# EAGLE design Alimentatore_LM317 (EAGLE 9.5.0)
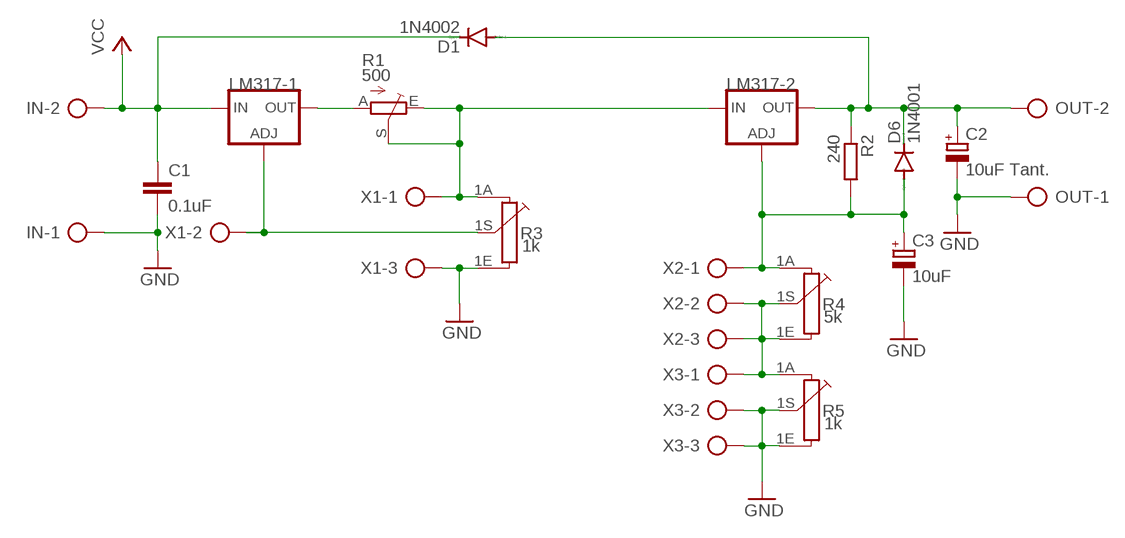
[diagram p0: schematic, sheet 1]

## Parts
C1  0.1uF  C-EU025-024X044  [C025-024X044]
C2  10uF Tant.  CPOL-EUE2-5  [E2-5]
C3  10uF  CPOL-EUE2-5  [E2-5]
D1  1N4002  1N4004DO-41  [DIOAD860W70L460D235B]
D6  1N4001  1N4004DO-41  [DIOAD860W70L460D235B]
IN  SMKDSP_1,5/2  [SMKDSP_1,5/2]
LM317-1  LM317TS317TS_TO220  [TO220V]
LM317-2  LM317TS317TS_TO220  [TO220V]
OUT  SMKDSP_1,5/2  [SMKDSP_1,5/2]
R1  500  TRIM_EU-CA6V  [CA6V]
R2  240  R-EU_0204/7  [0204/7]
R3  1k  PC16S  [PC16S]
R4  5k  PC16S  [PC16S]
R5  1k  PC16S  [PC16S]
X1  SMKDSP_1,5/3  [SMKDSP_1,5/3]
X2  SMKDSP_1,5/3  [SMKDSP_1,5/3]
X3  SMKDSP_1,5/3  [SMKDSP_1,5/3]

## Nets
GND: C1.2 C2.- C3.- IN.1 OUT.1 R3.1E R5.1E R5.1S X1.3 X3.2 X3.3
N$1: C2.+ D1.2(A) D6.1(C) LM317-2.2(OUT) OUT.2 R2.1
N$2: LM317-1.2(OUT) R1.A
N$3: LM317-2.3(IN) R1.E R1.S R3.1A X1.1
N$4: R4.1E R4.1S R5.1A X2.2 X2.3 X3.1
N$5: LM317-1.1(ADJ) R3.1S X1.2
N$9: C3.+ D6.2(A) LM317-2.1(ADJ) R2.2 R4.1A X2.1
VCC: C1.1 D1.1(C) IN.2 LM317-1.3(IN)

## Library data of the parts
C1 = rcl:C-EU: CAPACITOR, European symbol; SPICEPREFIX: C
C2 C3 = rcl:CPOL-EU: POLARIZED CAPACITOR, European symbol; SPICEPREFIX: C
D1 D6 = diode_MOD:1N4004: DIODE general purpose rectifier, 1 A
IN OUT = con-phoenix-smkdsp:SMKDSP_1,5/2: Printklemme, Nennstrom: 17,5 A, Bemessungsspannung: 250 V, Raster: 5,0 mm Source: http://eshop.phoenixcontact.de .. 1733415.pdf; MF: FARNELL; MPN: 1733570; OC_FARNELL: 3041244; OC_NEWARK: 69C8588
LM317-1 LM317-2 = v-reg:LM317TS: VOLTAGE REGULATOR
R1 = pot:TRIM_EU-: POTENTIOMETER
R2 = rcl:R-EU_: RESISTOR, European symbol; SPICEPREFIX: R
R3-R5 = piher:PC16S: POTENTIOMETER single carbon potentiometer, 16 mm, S3ROH; OC_FARNELL: 4452940; OC_NEWARK: unknown
X1-X3 = con-phoenix-smkdsp:SMKDSP_1,5/3: Printklemme, Nennstrom: 17,5 A, Bemessungsspannung: 250 V, Raster: 5,0 mm Source: http://eshop.phoenixcontact.de .. 1733415.pdf; MF: FARNELL; MPN: 1733583; OC_FARNELL: 3041256; OC_NEWARK: 71C4130

## Board
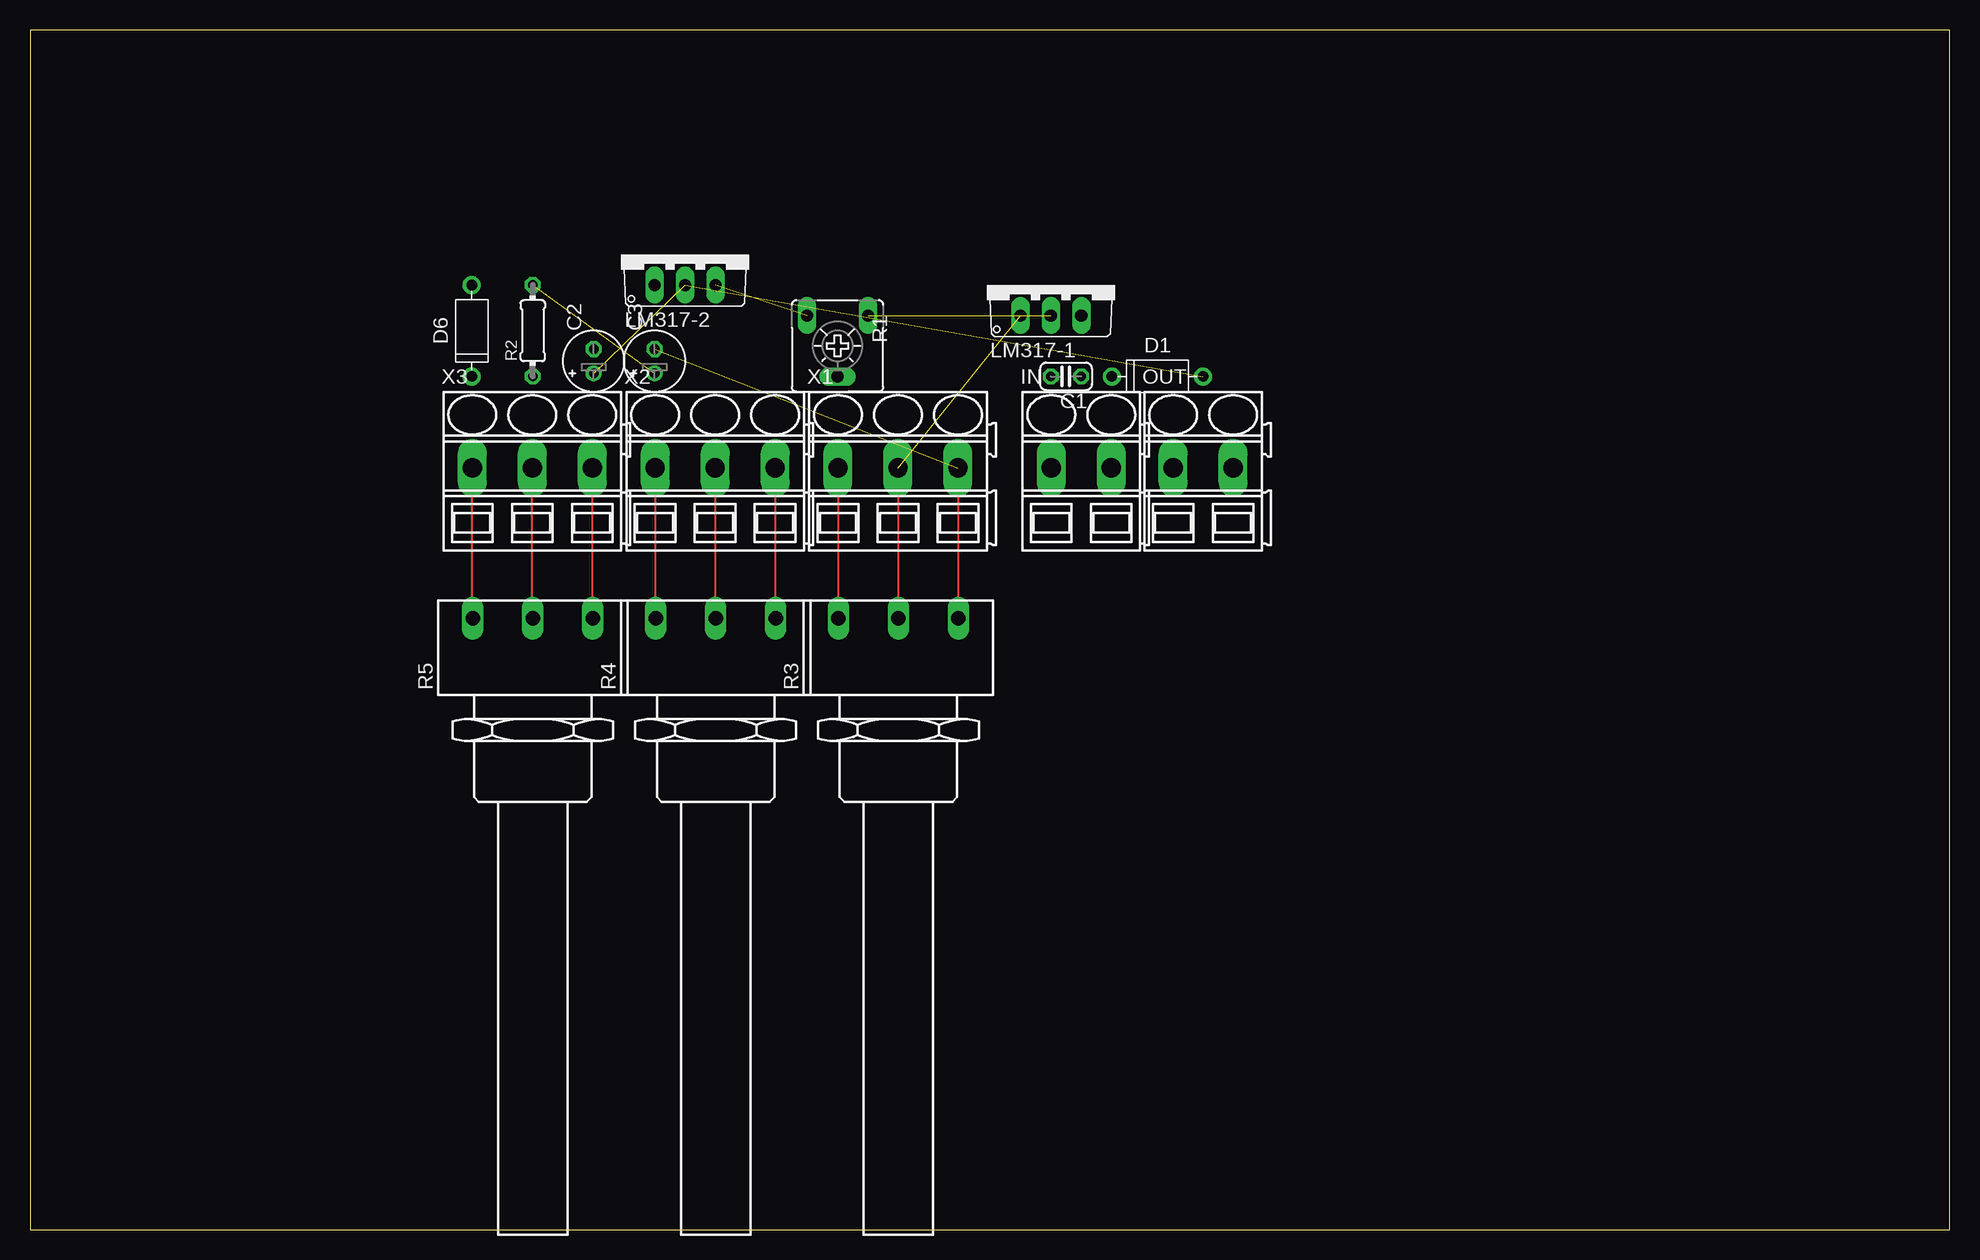
[diagram p1: board, top side]
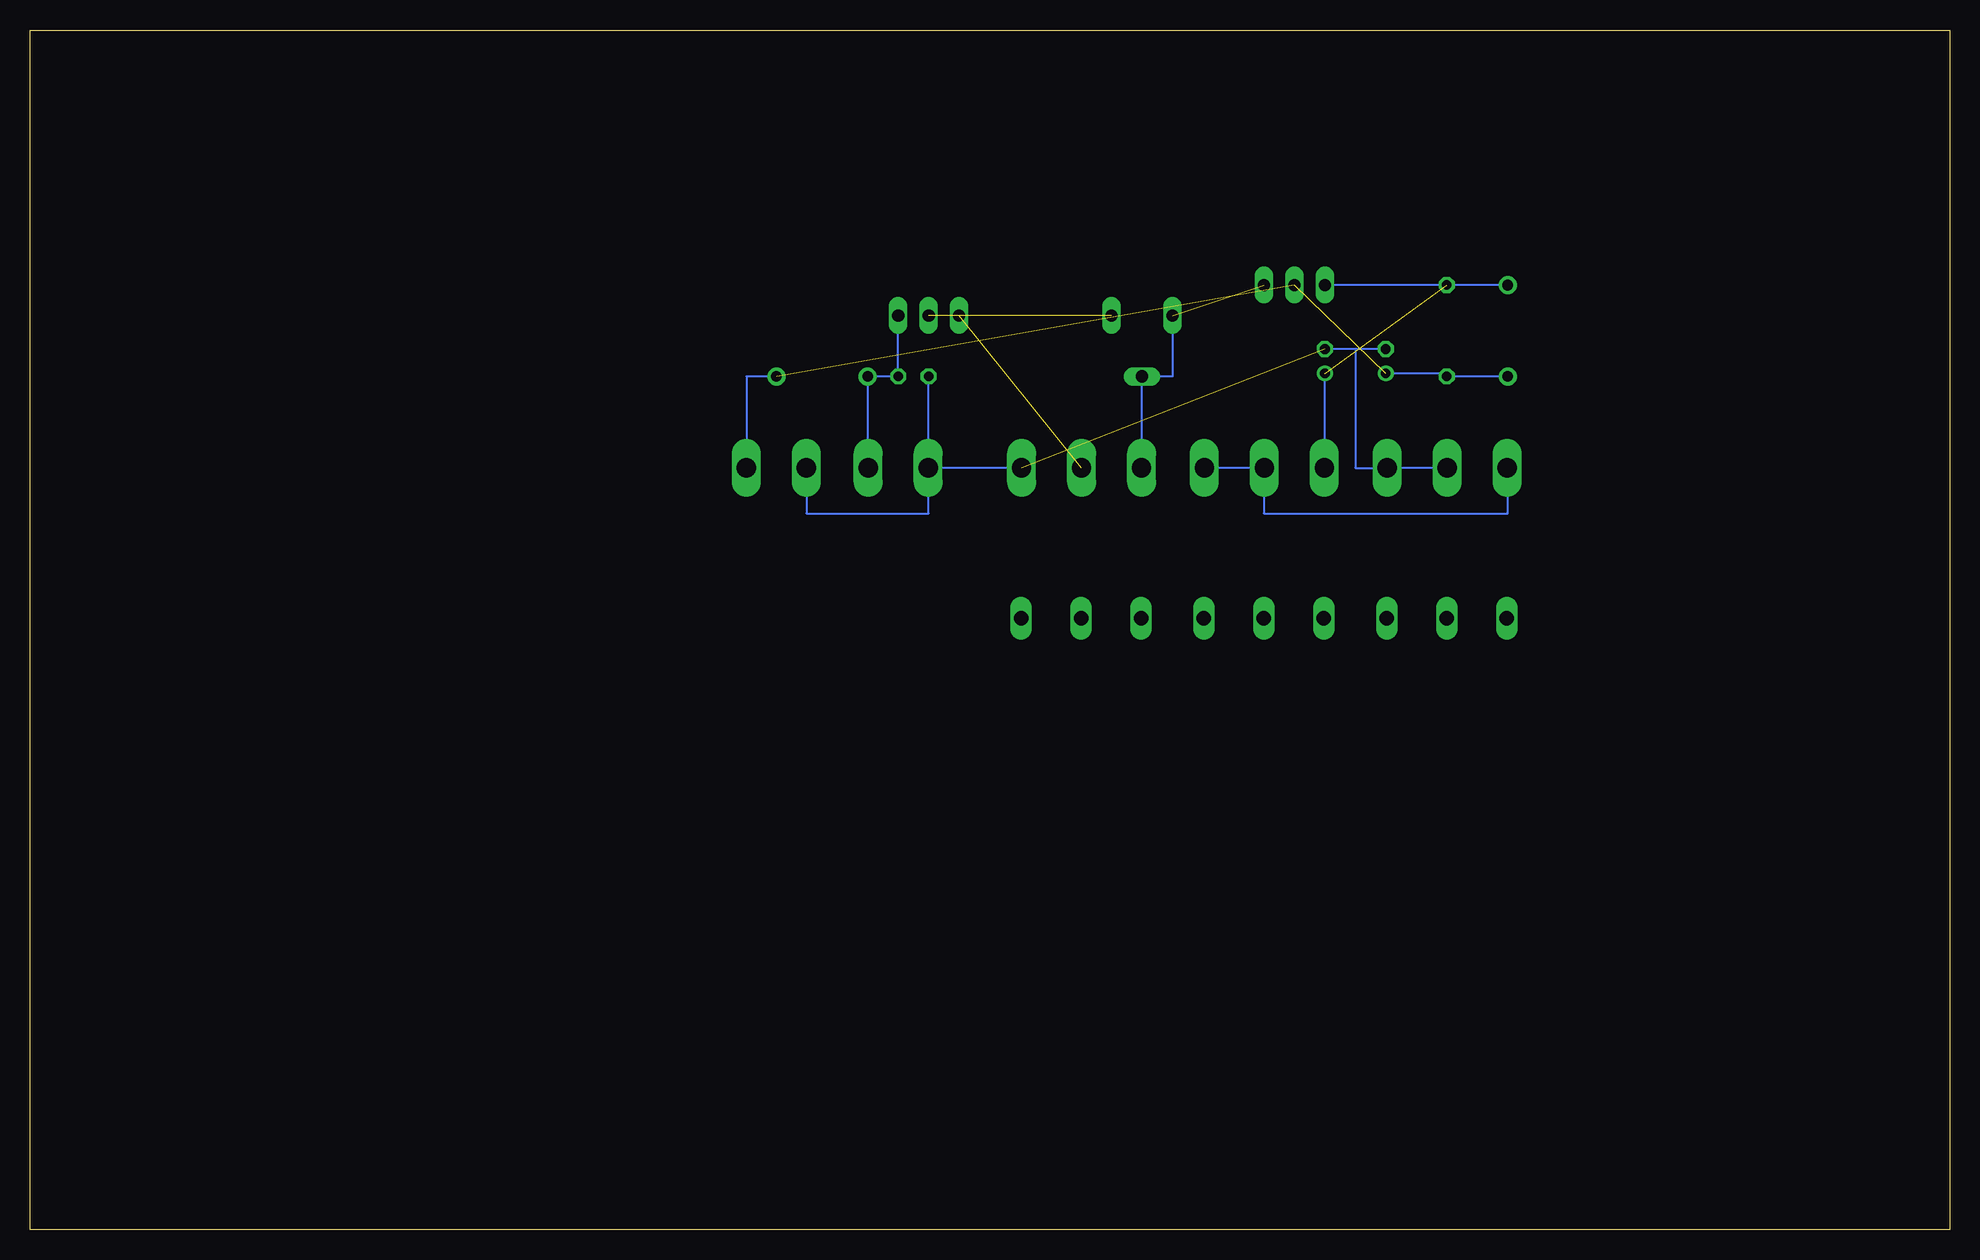
[diagram p2: board, bottom side, seen from below]

Size 160 x 100 mm. Coordinates in mm from the lower left corner, seen from the top.
Outline: 0,0 160,0 160,100 0,100 0,0
Copper layers (1*16): Top 0.035mm / dielectric 1.5mm / Bottom 0.035mm
Design rules "default": minimum track width 6mil, minimum drill 0.35mm, track to track 6mil, track to pad 6mil, pad to pad 6mil, via to via 6mil, smd to smd 6mil, copper to edge 40mil, drill to drill 6mil, minimum pad ring 10mil, minimum via ring 8mil, stop-mask expansion 4mil, vias tented up to drill 0mil, thermal gap 10mil

### Footprints (pad centres in the part's own frame; a part is rotated, then mirrored left to right if it is on the bottom)
C025-024X044 = drill 0.813 octagon: 1 -1.27,0; 2 1.27,0
E2-5 = drill 0.813 pad 1.27: + -1.016,0 | drill 0.813 pad 1.27 octagon: - 1.016,0
DIOAD860W70L460D235B = drill 0.9 pad 1.5: 1 -3.81,0; 2 3.81,0
SMKDSP_1,5/2 = drill 1.6 pad 1.8 long: 1 -2.5,0; 2 2.5,0
TO220V = drill 1.016 long: 1 -2.54,-2.54; 2 0,-2.54; 3 2.54,-2.54
CA6V = drill 1.016 long: A -2.54,-2.54; E 2.54,-2.54; S 0,2.54
0204/7 = drill 0.813 octagon: 1 -3.81,0; 2 3.81,0
PC16S = drill 1.2 long: 1A -5,6.5; 1E 5,6.5; 1S 0,6.5
SMKDSP_1,5/3 = drill 1.6 pad 1.8 long: 1 -2.5,0; 2 2.5,0; 3 7.5,0

### Placement (x,y rotation side)
C1  86.36,71.12 180 top
C2  46.99,72.39 90 top
C3  52.07,72.39 90 top
D1  93.98,71.12 0 top
D6  36.83,74.93 90 top
IN  87.63,63.5 0 top
LM317-1  85.09,78.74 0 top
LM317-2  54.61,81.28 0 top
OUT  97.79,63.5 0 top
R1  67.31,73.66 180 top
R2  41.91,74.93 90 top
R3  72.39,44.45 0 top
R4  57.15,44.45 0 top
R5  41.91,44.45 0 top
X1  69.85,63.5 0 top
X2  54.61,63.5 0 top
X3  39.37,63.5 0 top

### Tracks (layer width: path | path; a pad name or v marks a point on that pad's centre or on a via)
GND  (1 unrouted)
  Top 0.152: R5.1S 41.87,50.99 X3.2 | R5.1E 46.91,63.46 X3.3 | R3.1E 77.39,63.46 X1.3
  Bottom 0.152: X3.2 X3.3 49.53,63.5 49.53,73.41 | C1.2 85.13,71.12 IN.1 | C2.- 49.53,73.41 | 49.53,73.41 C3.- | X1.3 IN.1 | OUT.1 95.29,59.69 85.09,59.69 85.09,63.5 IN.1
N$1  (2 unrouted)
  Bottom 0.152: D1.2 100.29,71.12 OUT.2 | D6.1 R2.1 41.91,71.37 C2.+
N$2  (1 unrouted)
N$3  (1 unrouted)
  Top 0.152: R3.1A 67.39,63.46 X1.1
  Bottom 0.152: X1.1 67.31,63.5 R1.S 64.77,71.12 R1.E
N$4
  Top 0.152: R5.1A 36.87,50.99 X3.1 | R4.1S 57.15,63.46 X2.2 | R4.1E 62.15,63.46 X2.3
  Bottom 0.152: X2.3 X2.2 57.15,63.5 57.15,59.69 36.83,59.69 36.83,63.5 X3.1
N$5  (1 unrouted)
  Top 0.152: R3.1S 72.39,63.46 X1.2
N$9  (1 unrouted)
  Top 0.152: R4.1A 52.15,63.46 X2.1
  Bottom 0.152: 52.11,71.39 C3.+ 52.11,71.37 X2.1 | D6.2 R2.2 LM317-2.1
VCC
  Bottom 0.152: IN.2 90.17,63.5 D1.1 C1.1 LM317-1.3